# EAGLE design Comm (EAGLE 9.6.2)
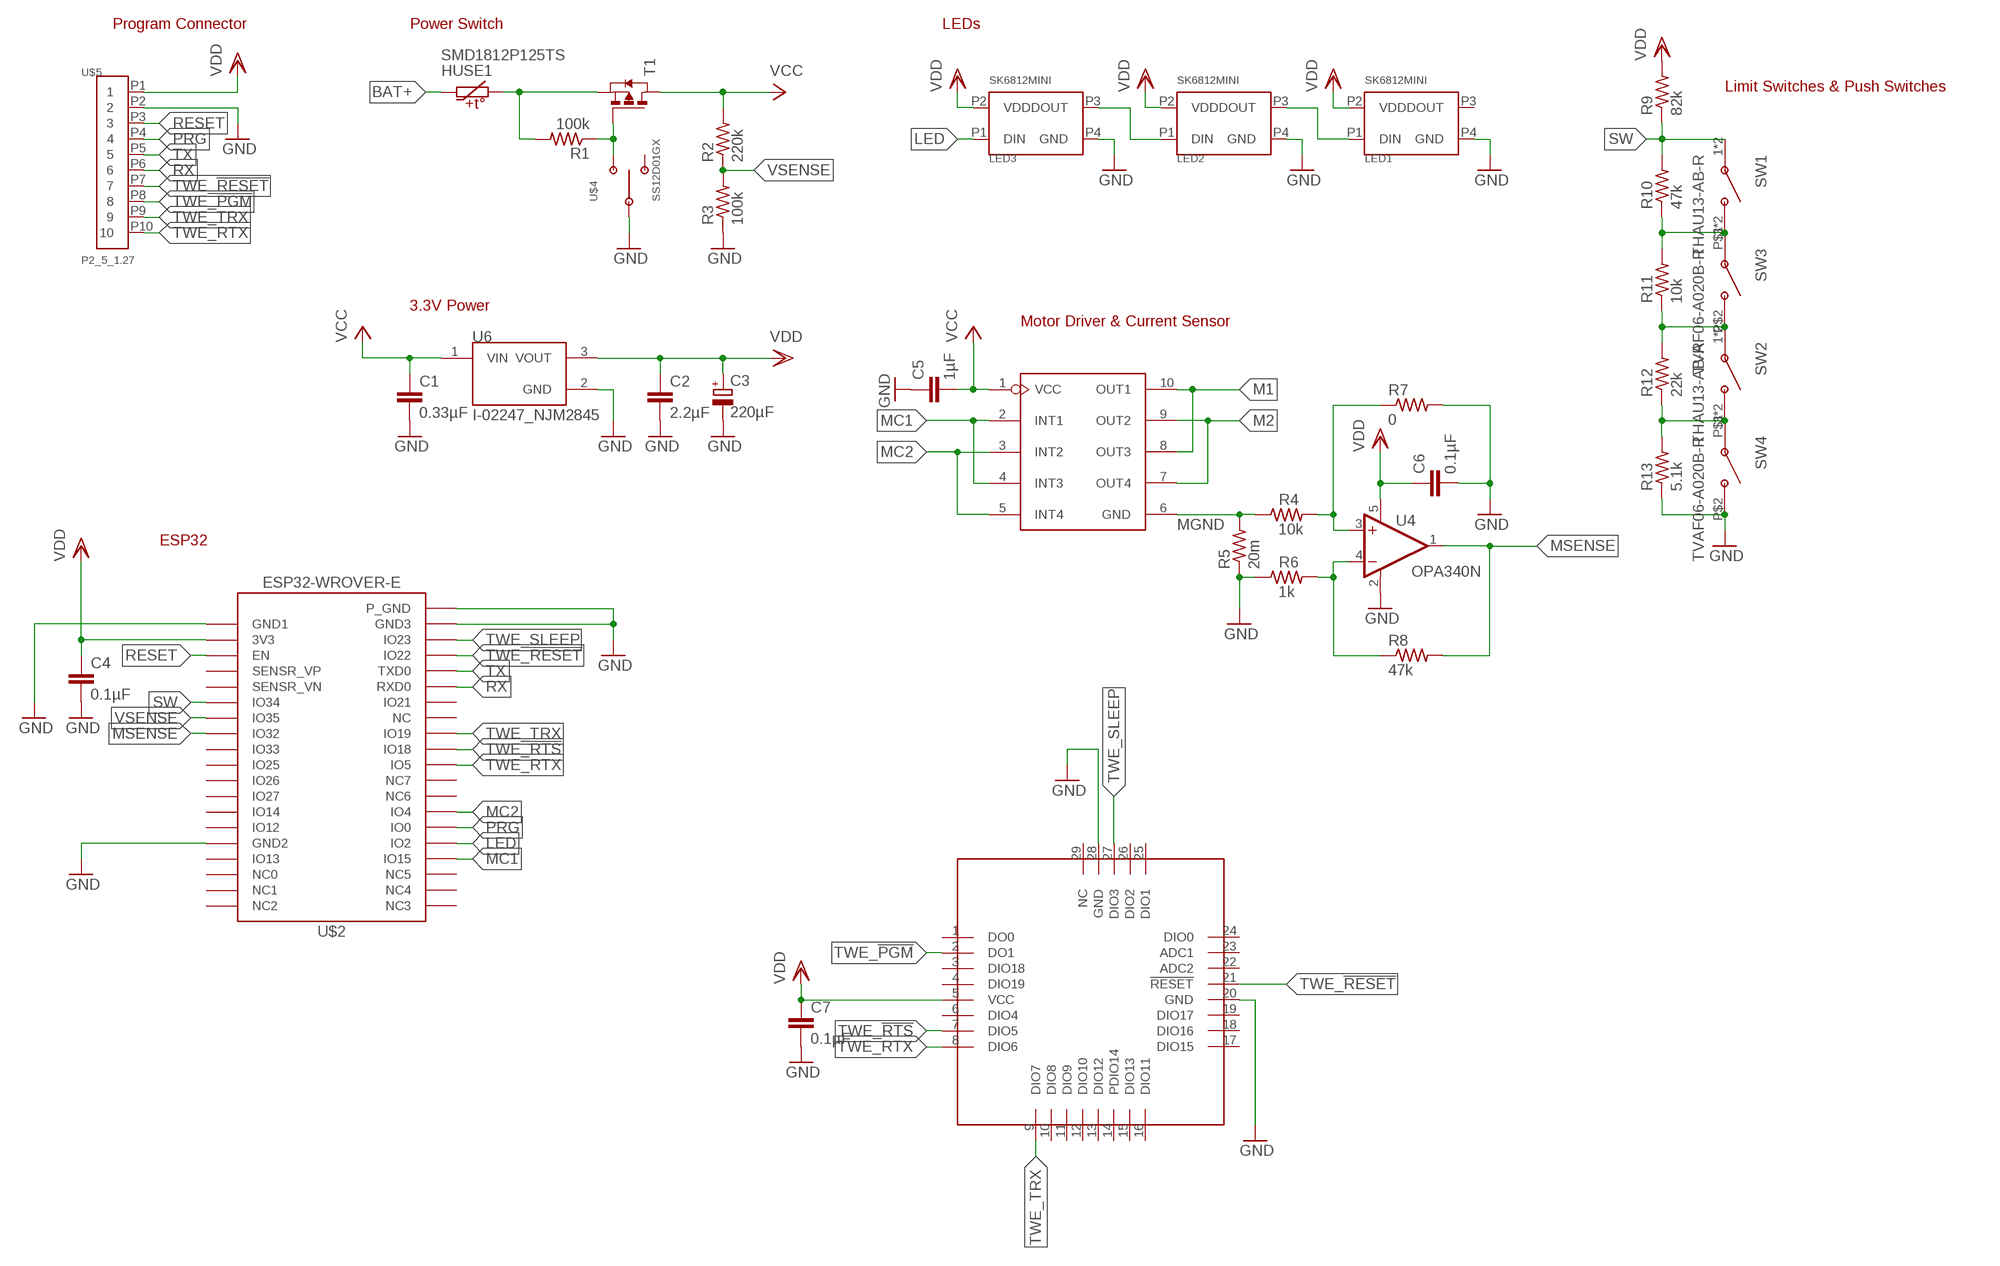
[diagram p0: schematic, sheet 1]

## Parts
C1  0.33µF  C-EUC0603  [C0603]
C2  2.2µF  C-EUC0603  [C0603]
C3  220µF  CPOL-EUUD-6,3X7,7  [UD-6,3X7,7_NICHICON]
C4  0.1µF  C-EUC0603  [C0603]
C5  1µF  C-EUC0603  [C0603]
C6  0.1µF  C-EUC0603  [C0603]
C7  0.1µF  C-EUC0603K  [C0603K]
HUSE1  SMD1812P125TS  [SMD1812P]
LED1  SK6812MINI  [SK68XXMINI]
LED2  SK6812MINI  [SK68XXMINI]
LED3  SK6812MINI  [SK68XXMINI]
R1  100k  R-US_R0603  [R0603]
R2  220k  R-US_R0603  [R0603]
R3  100k  R-US_R0603  [R0603]
R4  10k  R-US_R0603  [R0603]
R5  20m  R-US_R6332W  [R6332W]
R6  1k  R-US_R0603  [R0603]
R7  0  R-US_R0603  [R0603]
R8  47k  R-US_R0603  [R0603]
R9  82k  R-US_R0603  [R0603]
R10  47k  R-US_R0603  [R0603]
R11  10k  R-US_R0603  [R0603]
R12  22k  R-US_R0603  [R0603]
R13  5.1k  R-US_R0603  [R0603]
SW1  THAU13-AB-R  [THAU13-AB-R]
SW2  THAU13-AB-R  [THAU13-AB-R]
SW3  TVAF06-A020B-R  [TVAF06-A020B-R]
SW4  TVAF06-A020B-R  [TVAF06-A020B-R]
T1  PMOSSOT23  [SOT-23]
TWE-LITE  LITE  [LITE]
U4  OPA340N  [SOT23-5]
U5  DRIVER-LV8548MC-AH(SOIC10)  [SOIC10-1.0-5X4MM]
U6  I-02247_NJM2845  [TO252]
U$2  ESP32-WROVER-E  [ESP32-WROVER-E]
U$4  SS12D01GX  [SS12D01GX]
U$5  P2_5_1.27  [P2_5_1.27]

## Nets
BAT+: HUSE1.1
GND: C1.2 C2.2 C3.- C4.2 C5.1 C6.2 C7.2 LED1.P4(GND) LED2.P4(GND) LED3.P4(GND) R3.1 R5.1 R6.1 R7.2 R13.1 SW4.P$2(B) TWE-LITE.20(GND) TWE-LITE.28(GND) U4.2(V-) U6.2(GND) U$2.GND1 U$2.GND2 U$2.GND3 U$2.P_GND U$4.2(C) U$5.P2
LED: LED3.P1(DIN) U$2.IO2
M1: U5.8(OUT3) U5.10(OUT1)
M2: U5.7(OUT4) U5.9(OUT2)
MC1: U5.2(INT1) U5.4(INT3) U$2.IO15
MC2: U5.3(INT2) U5.5(INT4) U$2.IO4
MGND: R4.1 R5.2 U5.6(GND)
MSENSE: R8.2 U4.1(OUT) U$2.IO32
N$9: HUSE1.2 R1.2 T1.2(S)
N$11: R6.2 R8.1 U4.4(-IN)
N$12: R4.2 R7.1 U4.3(+IN)
N$13: R1.1 T1.3(G) U$4.1(A)
N$14: LED2.P1(DIN) LED3.P3(DOUT)
N$15: LED1.P1(DIN) LED2.P3(DOUT)
N$16: R11.1 R12.2 SW2.1(A) SW2.2(A) SW3.P$2(B)
N$17: R10.1 R11.2 SW1.3(B) SW1.4(B) SW3.P$1(A)
N$18: R12.1 R13.2 SW2.3(B) SW2.4(B) SW4.P$1(A)
PRG: U$2.IO0 U$5.P4
RESET: U$2.EN U$5.P3
RX: U$2.RXD0 U$5.P6
SW: R9.1 R10.2 SW1.1(A) SW1.2(A) U$2.IO34
TWE_!PGM!: TWE-LITE.2(DO1) U$5.P8
TWE_!RESET!: TWE-LITE.21(!RESET!) U$2.IO22 U$5.P7
TWE_!RTS!: TWE-LITE.7(DIO5) U$2.IO18
TWE_RTX: TWE-LITE.8(DIO6) U$2.IO5 U$5.P10
TWE_SLEEP: TWE-LITE.27(DIO3) U$2.IO23
TWE_TRX: TWE-LITE.9(DIO7) U$2.IO19 U$5.P9
TX: U$2.TXD0 U$5.P5
VCC: C1.1 C5.2 R2.2 T1.1(D) U5.1(VCC) U6.1(VIN)
VDD: C2.1 C3.+ C4.1 C6.1 C7.1 LED1.P2(VDD) LED2.P2(VDD) LED3.P2(VDD) R9.2 TWE-LITE.5(VCC) U4.5(V+) U6.3(VOUT) U$2.3V3 U$5.P1
VSENSE: R2.1 R3.2 U$2.IO35
Unconnected: LED1.P3(DOUT) TWE-LITE.1(DO0) TWE-LITE.3(DIO18) TWE-LITE.4(DIO19) TWE-LITE.6(DIO4) TWE-LITE.10(DIO8) TWE-LITE.11(DIO9) TWE-LITE.12(DIO10) TWE-LITE.13(DIO12) TWE-LITE.14(PDIO14) TWE-LITE.15(DIO13) TWE-LITE.16(DIO11) TWE-LITE.17(DIO15) TWE-LITE.18(DIO16) TWE-LITE.19(DIO17) TWE-LITE.22(ADC2) TWE-LITE.23(ADC1) TWE-LITE.24(DIO0) TWE-LITE.25(DIO1) TWE-LITE.26(DIO2) TWE-LITE.29(NC) U$2.IO12 U$2.IO13 U$2.IO14 U$2.IO16(NC6) U$2.IO17(NC7) U$2.IO21 U$2.IO25 U$2.IO26 U$2.IO27 U$2.IO33 U$2.NC U$2.NC0 U$2.NC1 U$2.NC2 U$2.NC3 U$2.NC4 U$2.NC5 U$2.SENSOR_VN(SENSR_VN) U$2.SENSOR_VP(SENSR_VP) U$4.3(B)

## Notes on the sheet
- Program Connector | Power Switch | LEDs
- Limit Switches & Push Switches
- 3.3V Power
- Motor Driver & Current Sensor
- ESP32

## Library data of the parts
C1 C2 C4-C7 = rcl:C-EU: CAPACITOR, European symbol; SPICEPREFIX: C
C3 = rcl:CPOL-EU: POLARIZED CAPACITOR, European symbol; SPICEPREFIX: C
HUSE1 = ptc:SMD1812P125TS
LED1-LED3 = leds:SK6812MINI
R1-R13 = rcl:R-US_: RESISTOR, American symbol; SPICEPREFIX: R
SW1 SW2 = switches:THAU13-AB-R
SW3 SW4 = switches:TVAF06-A020B-R
T1 = zetex:PMOSSOT23: MOS FET; OC_FARNELL: unknown; OC_NEWARK: unknown
TWE-LITE = TWELite:LITE
U4 = burr-brown:OPA340: Rail-to-Rail Operational Amplifiers Single-Supply, MicroAmplifier(TM) Series; MPN: OPA340NA/3KG4; OC_FARNELL: 1234805; OC_NEWARK: 13M5177
U5 = DRIVER-LV8548MC-AH_SOIC10_:DRIVER-LV8548MC-AH(SOIC10): 310030259 Check prices <https://pricing.snapeda.com/parts/LV8548MC-AH/ON%20Semiconductor/view-part?ref=eda>; AVAILABILITY: Not in stock; DESCRIPTION: Half Bridge (4) Driver DC Motors, General Purpose, Stepper Motors DMOS 10-SOIC; MF: ON Semiconductor; MP: LV8548MC-AH; PACKAGE: SOIC NB-10 ON Semiconductor; PRICE: None
U6 = akizuki:I-02247_NJM2845
U$2 = esp32:ESP32-WROVER-E
U$4 = switches:SS12D01GX
U$5 = pins:P2_5_1.27

## Board
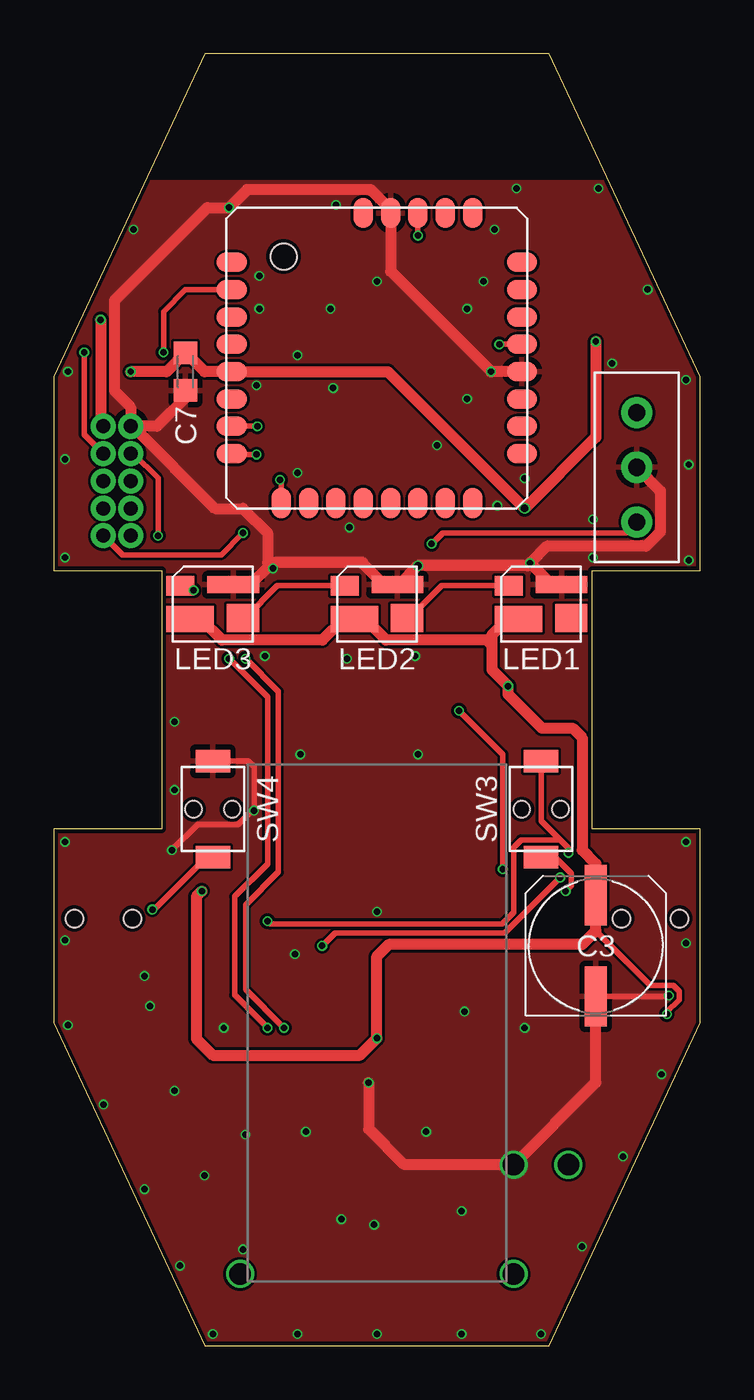
[diagram p1: board, top side]
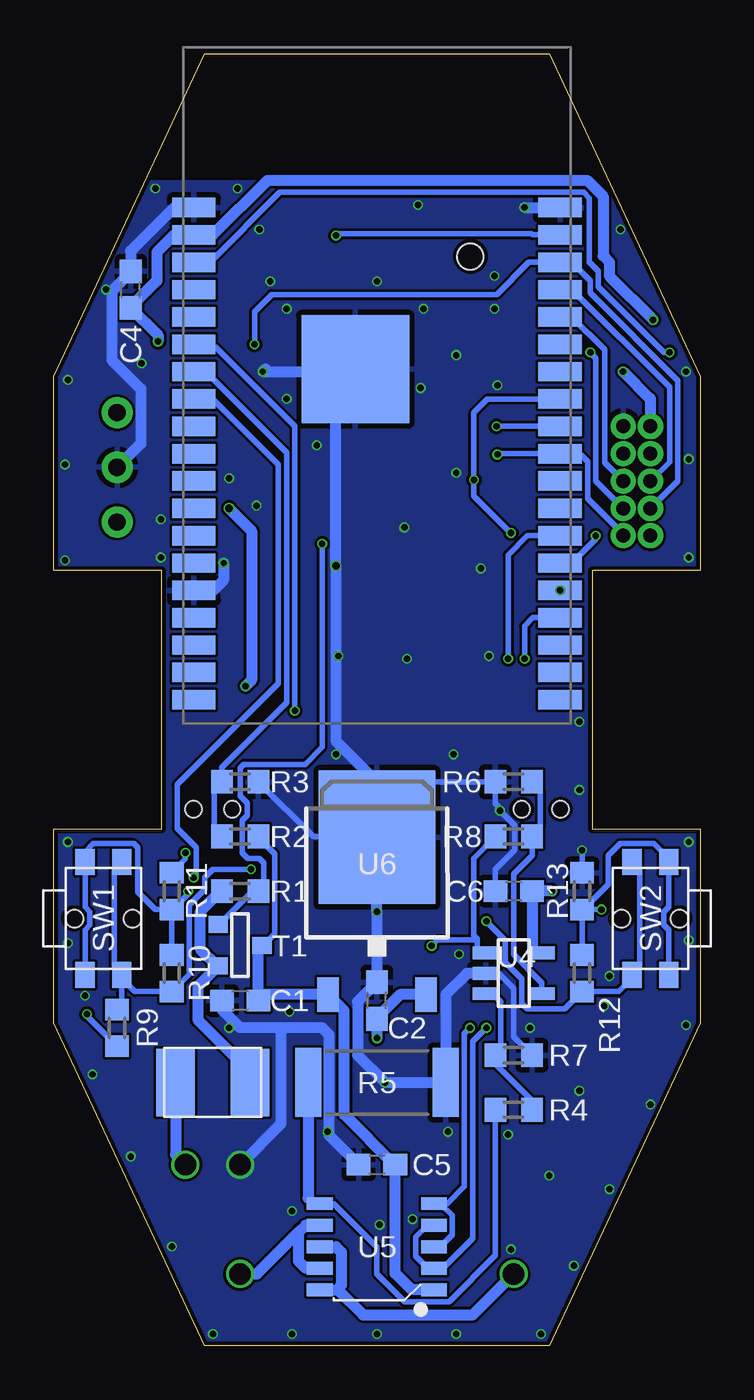
[diagram p2: board, bottom side, seen from below]

Size 30 x 60 mm. Coordinates in mm from the lower left corner, seen from the top.
Outline: 7,0 23,0 30,15 30,24 25,24 25,36 30,36 30,45 23,60 7,60 0,45 0,36 5,36 5,24 0,24 0,15 7,0
Copper layers (1*16): Top 0.035mm / dielectric 1mm / Bottom 0.035mm
Design rules "jlcpcb-2layers-1.0mm": minimum track width 5mil, minimum drill 0.3mm, track to track 5mil, track to pad 5mil, pad to pad 5mil, via to via 5mil, smd to smd 5mil, copper to edge 0.2mm, drill to drill 6mil, minimum pad ring 10mil, minimum via ring 3mil, stop-mask expansion 4mil, vias tented up to drill 0mil, thermal gap 10mil
tKeepout: area -35,27.5 to 65,32.5

### Footprints (pad centres in the part's own frame; a part is rotated, then mirrored left to right if it is on the bottom)
C0603 = smd 1.1 x 1: 1 -0.85,0; 2 0.85,0
UD-6,3X7,7_NICHICON = smd 2.8 x 1: + 2.35,0; - -2.35,0
C0603K = smd 1.05 x 1.08: 1 -0.875,0; 2 0.875,0
SMD1812P = smd 1.78 x 3.15: 1 -1.725,0; 2 1.725,0
SK68XXMINI = smd 1.3 x 0.9: P1 1.5,-0.85 | smd 2.2 x 1.2: P2 1.05,0.7 | smd 1.5 x 1.3: P3 -1.4,0.65 | smd 2.4 x 0.8: P4 -0.95,-0.9
R0603 = smd 1 x 1.1: 1 -0.85,0; 2 0.85,0
R6332W = smd 1.2 x 3.2: 1 -3.196,0; 2 3.196,0
THAU13-AB-R = smd 1.2 x 0.9: 1 -2.625,0.85; 2 2.625,0.85; 3 -2.625,-0.85; 4 2.625,-0.85 | hole 0.8: 0,1.35; 0,-1.35
TVAF06-A020B-R = smd 1.6 x 1.05: P$1 0,2.225; P$2 0,-2.225 | hole 0.75: -0.9,0; 0.9,0
SOT-23 = smd 0.787 x 0.889: 1 0.025,-1.016; 2 -0.94,1.016; 3 0.991,1.016
LITE = smd 1.4 x 0.9: 1 0.25,11.43; 2 0.25,10.16; 3 0.25,8.89; 4 0.25,7.62; 5 0.25,6.35; 6 0.25,5.08; 7 0.25,3.81; 8 0.25,2.54; 17 13.72,2.54; 18 13.72,3.81; 19 13.72,5.08; 20 13.72,6.35; 21 13.72,7.62; 22 13.72,8.89; 23 13.72,10.16; 24 13.72,11.43 | smd 0.9 x 1.4: 9 2.54,0.25; 10 3.81,0.25; 11 5.08,0.25; 12 6.35,0.25; 13 7.62,0.25; 14 8.89,0.25; 15 10.16,0.25; 16 11.43,0.25; 25 11.43,13.72; 26 10.16,13.72; 27 8.89,13.72; 28 7.62,13.72; 29 6.35,13.72 | hole 1.2: 2.65,11.7
SOT23-5 = smd 0.6 x 1.2: 1 -0.95,-1.306; 2 0,-1.306; 3 0.95,-1.306; 4 0.95,1.306; 5 -0.95,1.306
SOIC10-1.0-5X4MM = smd 0.6 x 1.2: 1 -2,-2.65; 2 -1,-2.65; 3 0,-2.65; 4 1,-2.65; 5 2,-2.65; 6 2,2.65; 7 1,2.65; 8 0,2.65; 9 -1,2.65; 10 -2,2.65
TO252 = smd 1 x 1.6: 1 -2.28,-4.8; 3 2.28,-4.8 | smd 5.4 x 6.2: 2 0,2.5
ESP32-WROVER-E = smd 2 x 0.9: 3V3 -8.5,10.16; EN -8.5,8.89; GND1 -8.5,11.43; GND2 -8.5,-6.35; GND3 8.5,11.43; IO0 8.5,-5.08; IO2 8.5,-6.35; IO4 8.5,-3.81; IO5 8.5,0; IO12 -8.5,-5.08; IO13 -8.5,-7.62; IO14 -8.5,-3.81; IO15 8.5,-7.62; IO16 8.5,-2.54; IO17 8.5,-1.27; IO18 8.5,1.27; IO19 8.5,2.54; IO21 8.5,5.08; IO22 8.5,8.89; IO23 8.5,10.16; IO25 -8.5,0; IO26 -8.5,-1.27; IO27 -8.5,-2.54; IO32 -8.5,2.54; IO33 -8.5,1.27; IO34 -8.5,5.08; IO35 -8.5,3.81; NC 8.5,3.81; NC0 -8.5,-8.89; NC1 -8.5,-10.16; NC2 -8.5,-11.43; NC3 8.5,-11.43; NC4 8.5,-10.16; NC5 8.5,-8.89; RXD0 8.5,6.35; SENSOR_VN -8.5,6.35; SENSOR_VP -8.5,7.62; TXD0 8.5,7.62 | smd 5 x 5: P_GND -1,3.93
SS12D01GX = drill 0.8: 1 -2.54,0; 2 0,0; 3 2.54,0
P2_5_1.27 = drill 0.65 pad 1.016: P1 0,2.54; P2 1.27,2.54; P3 0,1.27; P4 1.27,1.27; P5 0,0; P6 1.27,0; P7 0,-1.27; P8 1.27,-1.27; P9 0,-2.54; P10 1.27,-2.54

### Placement (x,y rotation side)
C1  21.35,16.03 180 bottom
C2  15,16.03 90 bottom
C3  25.16,18.57 90 top
C4  26.43,49.05 90 bottom
C5  15,8.41 0 bottom
C6  8.65,21.11 180 bottom
C7  6.11,45.24 270 top
HUSE1  22.62,12.22 0 bottom
LED1  22.62,34.45 180 top
LED2  15,34.45 180 top
LED3  7.38,34.45 180 top
R1  21.35,21.11 180 bottom
R2  21.35,23.65 0 bottom
R3  21.35,26.19 180 bottom
R4  8.65,10.95 0 bottom
R5  15,12.22 180 bottom
R6  8.65,26.19 0 bottom
R7  8.65,13.49 0 bottom
R8  8.65,23.65 180 bottom
R9  27.06,14.76 270 bottom
R10  24.52,17.3 270 bottom
R11  24.52,21.11 270 bottom
R12  5.47,17.3 270 bottom
R13  5.47,21.11 270 bottom
SW1  27.7,19.84 270 bottom
SW2  2.3,19.84 90 bottom
SW3  22.62,24.92 180 top
SW4  7.38,24.92 180 top
T1  21.35,18.57 90 bottom
TWE-LITE  8.02,38.89 0 top
U4  8.65,17.3 270 bottom
U5  15,4.6 90 bottom
U6  15,21.11 0 bottom
U$2  15,41.43 0 bottom
U$4  27.06,40.8 90 top
U$5  2.3,40.16 0 top

### Tracks (layer width: path | path; a pad name or v marks a point on that pad's centre or on a via)
BAT+  (via drill 1 pad 1.3)
  Bottom 0.508: v23.89,8.41 24.34,8.86 HUSE1.1
GND  (via drill 0.3, 0.35, 1 pad 1.3)
  Top 0.254: C3.- 28.51,16.22 v28.55,16.26 | SW4.P$2 9.03,27.14 9.29,26.88 v9.29,24.85 9.21,24.85 8.57,24.22 6.68,24.22 v5.47,23.02
  Top 0.508: C7.2 6.11,44.02 4.79,42.7 U$5.P2 | TWE-LITE.20 v20.3,45.24 15.63,49.91 TWE-LITE.28 15.63,52.77 14.71,53.69 8.97,53.69 v8.14,52.86 7.13,52.86 2.81,48.54 2.81,44.35 3.57,43.59 U$5.P2 | LED2.P4 15.15,35.34 | 10.03,36.24 10.16,36.38 14.34,36.38 14.37,36.35 14.37,36.3 15.31,35.34 LED2.P4 | 10.03,36.24 9.13,35.34 LED3.P4 | LED2.P4 16.03,35.34 v16.91,36.22 21.98,36.22 v22.11,36.35 | LED1.P4 23.12,35.34 v22.11,36.35 | C3.- 25.16,12.22 v21.35,8.41 16.27,8.41 14.62,10.06 v14.62,12.22 | U$4.2 28.17,39.69 28.17,37.8 27.49,37.13 22.89,37.13 v22.11,36.35 | U$5.P2 3.67,42.7 7.48,38.89 8.78,38.89 9.92,37.75 9.92,36.35 10.03,36.24
  Bottom 0.254: U4.2 9.35,17.3 8.65,16.6 8.65,14.34 R7.2 | R6.1 12.42,26.19 14.96,23.65 | 14.96,23.65 U6.2 | R3.1 17.96,23.65 14.96,23.65 | R6.1 9.5,26.24 | 9.45,21.11 C6.2 9.5,22.13 8.61,23.02 8.61,24.17 v9.29,24.85 9.29,24.98 9.5,25.19 R6.1 | v5.47,23.02 R13.1
  Bottom 0.508: 20.18,45.36 v20.3,45.24 16.12,45.24 U$2.P_GND | U$2.GND1 24.41,52.86 26.43,50.84 C4.2 26.43,49.85 27.31,48.97 27.31,45.78 25.96,44.43 25.96,41.9 U$4.2 | C5.1 17.21,9.77 17.21,14.44 17.54,14.76 19.45,14.76 | 19.45,14.76 21.35,14.76 22.2,15.61 C1.2 | U4.2 10.81,17.3 11.8,16.3 R5.1 v14.62,12.22 15.89,13.49 15.89,15.99 C2.2 v15,20.16 U6.2 15,26.19 16.91,28.09 v16.91,36.22 16.91,45.36 U$2.P_GND | v22.11,36.35 22.11,35.56 22.59,35.08 U$2.GND2 | v8.14,52.86 U$2.GND3 | U$2.P_GND 15.88,45.24 | 15,44.36 U$2.P_GND | v21.35,8.41 19.45,10.32 19.45,14.76
  other vias: 29.48,36.48 25.03,36.6 25.03,38.38 29.48,40.92 29.35,44.86 25.92,45.62 27.57,49.05 25.29,53.75 21.48,53.75 20.46,51.84 19.95,49.43 13.1,52.99 3.7,51.84 9.54,49.69 15,49.43 19.19,48.16 12.84,48.16 9.54,48.16 11.32,46 12.97,44.48 9.41,44.61 19.19,43.97 17.79,41.81 11.32,40.54 0.65,45.24 0.52,41.18 0.52,36.6 13.73,38 10.17,36.1 20.59,39.02 21.86,40.29 16.78,32.03 13.6,31.91 9.79,32.03 11.44,27.46 16.91,27.46 5.6,28.98 5.6,25.81 0.52,23.4 0.52,18.82 4.21,17.17 4.46,15.78 0.65,14.89 7.89,14.76 11.19,18.19 5.6,11.84 2.3,11.2 8.9,9.81 7,7.9 4.21,7.27 5.86,3.71 8.78,4.47 7.38,0.54 11.32,0.54 15,0.54 18.94,0.54 22.62,0.54 24.52,4.6 18.94,6.25 11.7,9.93 17.29,9.93 14.87,5.62 13.35,5.87 19.06,15.52 21.86,14.76 26.43,8.79 28.21,12.6 29.35,18.7 29.35,23.4
  pour Top: -2.78,54.13 34.05,54.13 34.05,-4.29 -2.78,-4.29
  pour Bottom: -5.32,54.13 37.86,54.13 37.86,-5.56 -5.32,-5.56
LED  (via drill 0.3)
  Top 0.254: v6.49,35.08 6.28,35.3 LED3.P1
  Bottom 0.254: U$2.IO2 v6.49,35.08
M1  (via drill 1 pad 1.3)
  Bottom 0.508: U5.8 16.91,4.6 16.65,4.35 16.65,2.82 16.87,2.6 | U5.10 16.87,2.6 | 16.87,2.6 16.81,2.6 15.63,1.43 10.55,1.43 v8.65,3.33
M2  (via drill 1 pad 1.3)
  Bottom 0.508: U5.9 18.31,3.6 18.63,3.92 18.63,5.28 | 18.63,5.28 18.31,5.6 U5.7 | v21.35,3.33 20.58,3.33 18.63,5.28
MC1  (via drill 0.3)
  Top 0.254: v9.92,14.76 8.4,16.28 8.4,20.86 9.92,22.38 9.92,30.13 v8.14,31.91
  Bottom 0.254: U5.4 12.65,5.6 13.2,5.05 13.2,4.15 12.65,3.6 U5.2 11.94,3.6 10.55,4.98 10.55,14.12 v9.92,14.76 | U$2.IO15 7.76,33.81 8.14,33.43 v8.14,31.91
MC2  (via drill 0.3)
  Top 0.254: v8.9,31.91 10.43,30.38 10.43,22 8.9,20.48 8.9,16.54 v10.68,14.76
  Bottom 0.254: U5.3 12.05,4.6 11.5,5.15 11.5,6.05 12.05,6.6 U5.5 11.73,6.6 10.94,7.39 10.94,14.51 v10.68,14.76 | U$2.IO4 8.02,37.62 8.9,36.73 v8.9,31.91
MGND
  Bottom 0.254: U5.6 17,6.6 15,4.6 15,3.33 13.72,2.05 11.64,2.05 9.5,4.19 R4.1
  Bottom 0.508: R5.2 18.2,6.85 17.95,6.6 U5.6
MSENSE  (via drill 0.3)
  Top 0.254: v12.46,18.57 13.06,19.17 20.93,19.17 v23.51,21.74
  Bottom 0.254: R8.2 10.52,22.63 10.52,19.06 10.34,18.88 10.34,18.84 | 10.34,18.84 10.34,18.25 U4.1 | 10.34,18.84 12.19,18.84 v12.46,18.57 | v23.51,21.74 23.38,21.87 23.38,23.14 24.27,24.03 24.27,26.06 19.57,30.76 19.57,40.92 22.62,43.97 U$2.IO32
N$9
  Bottom 0.508: HUSE1.2 20.89,12.73 23.31,15.14 23.31,16.69 T1.2 22.42,17.63 23.19,18.41 23.19,20.17 22.25,21.11 R1.2
N$11
  Bottom 0.254: R6.2 7.42,25.81 7.42,24.03 R8.1 | R8.1 7.8,23.4 | 7.64,16.35 U4.4 7.34,16.86 8.65,18.16 8.65,21.91 7.8,22.76 R8.1
N$12
  Bottom 0.254: R4.2 7.8,11.38 9.5,13.08 R7.1 9.25,13.74 9.25,15.97 9.63,16.35 U4.3
N$13  (via drill 0.3)
  Top 0.254: U$4.1 26.56,37.75 18.05,37.75 v17.54,37.24
  Bottom 0.254: T1.3 22.32,19.56 20.77,21.11 R1.1 20.25,21.36 20.25,22.42 20.46,22.63 21.01,22.63 21.25,22.88 21.25,24.39 21.02,24.63 21.02,25.21 21.35,25.54 21.35,26.82 21.17,27 18.34,27 17.54,27.8 v17.54,37.24
N$14
  Top 0.254: LED2.P1 10.38,35.3 8.88,33.8 LED3.P3
N$15
  Top 0.254: 16.45,33.74 LED2.P3 16.5,33.8 18,35.3 LED1.P1
N$16  (via drill 0.3)
  Top 0.254: v23.89,22.89 23.89,23.11 23.51,23.49 | 23.51,23.49 22.62,24.38 SW3.P$2 | v9.92,19.71 10.05,19.59 20.81,19.59 21.35,20.12 21.35,23.14 21.7,23.49 23.51,23.49
  Bottom 0.254: R11.1 23.89,22.59 v23.89,22.89 | SW2.2 2.8,22.11 2.8,17.57 SW2.1 3.15,17.06 3.77,16.45 R12.2 6.28,15.65 8.02,15.65 8.27,15.9 8.27,17.05 9.03,17.81 9.03,18.82 v9.92,19.71
N$17  (via drill 0.3)
  Top 0.254: SW3.P$1 23.26,22.7 24.02,21.93 24.02,21.36 v23.76,21.11
  Bottom 0.254: R11.2 24.48,20.26 23.76,20.97 v23.76,21.11 | SW1.4 28.55,19.31 28.32,19.54 28.32,20.14 28.55,20.37 SW1.3 28.55,22.94 28.17,23.32 26.3,23.32 26.11,23.13 26.11,21.08 25.29,20.26 R11.2 | R10.1 R11.2
N$18  (via drill 0.3)
  Top 0.254: v4.57,20.26 4.67,20.26 7.11,22.7 SW4.P$1
  Bottom 0.254: R13.2 5.43,20.26 4.26,21.42 4.26,22.76 3.71,23.32 2.15,23.32 1.45,22.62 SW2.4 1.45,20.37 1.68,20.14 1.68,19.54 1.45,19.31 SW2.3 | R12.1 R13.2 | R13.2 v4.57,20.26
PRG  (via drill 0.3)
  Top 0.254: U$5.P4 3.7,41.43 4.84,40.29 v4.84,37.62
  Bottom 0.254: U$2.IO0 5.95,36.35 4.84,37.46 v4.84,37.62
RESET  (via drill 0.3)
  Top 0.254: U$5.P3 1.41,42.32 v1.41,46.13
  Bottom 0.254: U$2.EN 22.75,50.32 19.5,53.56 5.39,53.56 5.13,53.3 5.13,50.36 5.13,50.32 4.71,49.9 4.71,49.18 1.66,46.13 v1.41,46.13
RX
  Bottom 0.254: U$2.RXD0 5.95,47.78 4.42,46.25 4.42,41.01 U$5.P6
SW  (via drill 0.3)
  Top 0.254: v20.84,22.13 20.84,27.46 v18.81,29.49
  Bottom 0.254: SW1.2 27.2,17.57 27.2,22.11 SW1.1 | SW1.2 26.85,17.06 26.23,16.45 R10.2 23.72,17.25 23.72,20.47 23,21.19 23,21.74 22.62,22.13 v20.84,22.13 | R9.1 26.85,15.82 SW1.2 | U$2.IO34 23.37,46.38 22.49,46.38 18.81,42.7 v18.81,29.49
TWE_!PGM!  (via drill 0.3)
  Top 0.254: TWE-LITE.2 6.11,49.05 5.09,48.03 v5.09,46.13
  Bottom 0.254: v5.09,46.13 4.84,45.88 4.84,40.16 U$5.P8
TWE_!RESET!  (via drill 0.3)
  Top 0.254: TWE-LITE.21 v20.68,46.51
  Bottom 0.254: v20.68,46.51 20.68,48.03 19.89,48.83 9.45,48.83 7.95,50.32 U$2.IO22 5.95,50.32 5.11,49.48 5.11,48.9 1.03,44.83 1.03,40.16 U$5.P7
TWE_!RTS!  (via drill 0.3)
  Top 0.254: TWE-LITE.7 v9.45,42.7
  Bottom 0.254: v9.45,42.7 U$2.IO18
TWE_RTX  (via drill 0.3)
  Top 0.254: TWE-LITE.8 8.31,41.39 v9.41,41.39
  Bottom 0.254: v9.41,41.39 9.37,41.43 U$2.IO5 6.44,41.37 5.52,41.37 5.22,41.07 5.22,39.35 3.57,37.7 U$5.P10
TWE_SLEEP  (via drill 0.3)
  Top 0.254: TWE-LITE.27 v16.91,51.56
  Bottom 0.254: v16.91,51.56 16.82,51.64 7.82,51.64 7.77,51.59 U$2.IO23
TWE_TRX  (via drill 0.3)
  Top 0.254: TWE-LITE.9 10.55,40.16 v10.5,40.21 | v8.78,37.75 7.76,36.73 3.19,36.73 U$5.P9
  Bottom 0.254: v8.78,37.75 10.5,39.47 v10.5,40.21 10.5,43.34 9.87,43.97 U$2.IO19
TX
  Bottom 0.254: U$5.P5 1.41,41.05 1.41,44.51 5.95,49.05 U$2.TXD0
VCC
  Bottom 0.254: T1.1 20.28,18.59 19.75,19.13 19.75,22.85 20.5,23.6 R2.2
  Bottom 0.508: U5.1 13.39,2.6 14.15,3.36 C5.2 14.2,8.41 16.53,10.74 16.53,15.56 U6.1 20.22,16.31 C1.1 20.5,18.43 T1.1
VDD  (via drill 0.3, 0.35)
  Top 0.254: LED3.P2 5.83,33.74 5.63,33.54 | 25.16,19.27 27.69,16.74 28.75,16.74 29.03,16.46 29.03,16.06 28.46,15.49 v28.46,15.39
  Top 0.508: v3.57,45.24 5.23,45.24 C7.1 6.12,46.11 7,45.24 TWE-LITE.5 15.51,45.24 v21.86,38.89 25.16,42.19 v25.16,46.64 | LED1.P2 21.07,33.74 20.33,33.01 20.33,32.54 | LED3.P2 6.83,33.74 7.81,32.76 12.47,32.76 13.45,33.74 LED2.P2 14.45,33.74 15.43,32.76 20.11,32.76 20.33,32.54 | 20.33,32.54 20.33,31.4 v21.1,30.64 21.1,30.25 22.66,28.69 24.09,28.69 24.52,28.25 24.52,23.02 25.16,22.38 C3.+ 25.16,19.27 24.52,18.63 15.55,18.63 15,18.09 v15,14.28 14.21,13.49 7.38,13.49 6.62,14.25 6.62,20.86 v6.87,21.11 | v2.17,47.65 2.17,42.83 U$5.P1
  Bottom 0.254: R9.2 28.46,15.31 v28.46,15.39 | 2.35,43.97 2.35,44.02
  Bottom 0.508: v3.57,45.24 2.35,44.02 2.3,43.97 U$5.P1 | U6.3 13.92,16.31 15,15.23 C2.1 v15,14.28 | v21.86,38.89 20.81,37.85 20.81,30.92 v21.1,30.64 | v25.16,46.64 25.16,46.93 C4.1 26.43,48.25 25.21,49.47 25.21,50.78 24.41,51.59 U$2.3V3 22.62,51.59 20.08,54.13 5.24,54.13 4.5,53.39 4.5,50.61 4.21,50.32 4.21,49.69 v2.17,47.65 | v6.87,21.11 C6.1 7.8,18.25 U4.5
VSENSE
  Bottom 0.254: R2.1 22.55,24 22.55,25.84 R3.2 22.2,26.86 19.19,29.87 19.19,41.48 22.95,45.24 U$2.IO35

### Text on the board
tStop: 2022 WASA Rocket